# Altium schematic sheet Digital IO LS.SchDoc
size 297 x 209 mm; CompanyName: Sainsbury Wellcome Centre; Organization: FabLab; Address1: Sainsbury Wellcome Centre; Address2: 25 Howland Street; Address3: London; Address4: W1T 4JG; DocumentNumber: 9; SheetNumber: 9; SheetTotal: 12; swcgroup: FabLab; Org: Sainsbury Wellcome Centre; Add1: 25 Howland Street; Add2: London; Add3: W1T 4JG; WebAddress: www.sainsburywellcome.org; SheetSize: A4; SheetName: Level Shifter
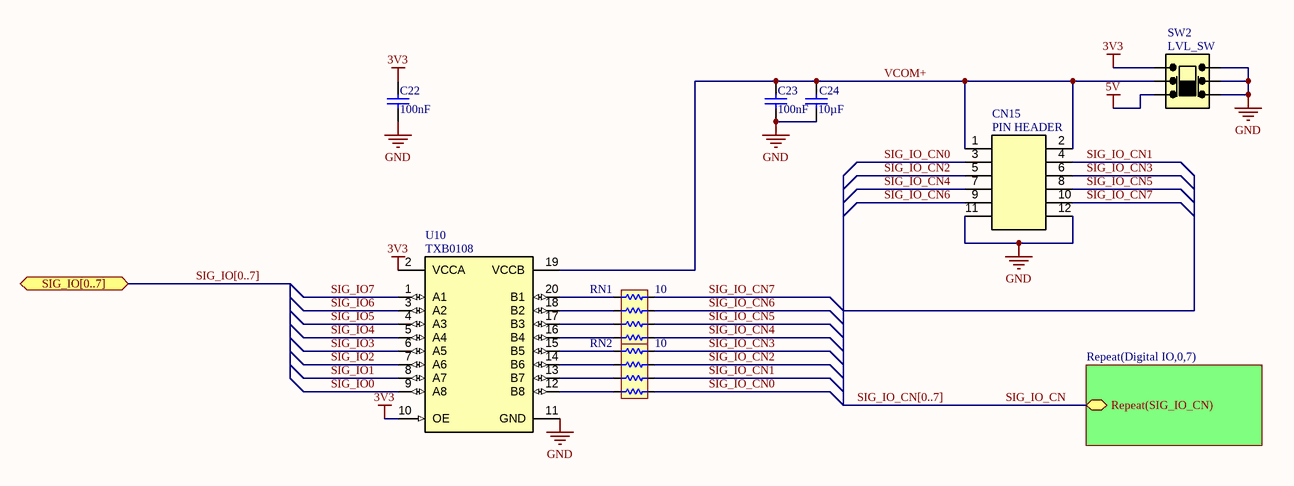
[diagram p0: Digital IO LS.SchDoc]

## Parts
C22  value 100nF  [CAP_CHIP_0603]  (hidden comment: C0603-100nF-50V)
C23  value 100nF  [CAP_CHIP_0603]  (hidden comment: C0603-100nF-50V)
C24  value 10µF  [CAP_CHIP_0603]  (hidden comment: C0603-10uF-35V)
CN15  PIN HEADER  [PIN_2.54_2X6P]
RN1  value 10  [RES_ARRAY_0603]  (hidden comment: RN0603-10R)
RN2  value 10  [RES_ARRAY_0603]  (hidden comment: RN0603-10R)
SW2  LVL_SW  [SW_SLIDE_OS202013MT8]
U10  TXB0108  [TSSOP20_6.5X4.4_0.65E]

## Sub-sheets
Repeat(Digital IO,0,7) = Digital IO Connector.SchDoc: Repeat(SIG_IO_CN) (bidir)

## Ports
SIG_IO[0..7] (bidir)

## Nets
3V3: C22.2 SW2.3(NOA) U10.2(VCCA) U10.10(OE)
5V: SW2.1(NCA)
GND: C22.1 C23.1 C24.1 CN15.11 CN15.12 SW2.4(NCB) SW2.5(COMB) SW2.6(NOB) U10.11(GND)
SIG_IO0: U10.9(A8)
SIG_IO1: U10.8(A7)
SIG_IO2: U10.7(A6)
SIG_IO3: U10.6(A5)
SIG_IO4: U10.5(A4)
SIG_IO5: U10.4(A3)
SIG_IO6: U10.3(A2)
SIG_IO7: U10.1(A1)
SIG_IO_CN: sheet Repeat(Digital IO,0,7)/Repeat(SIG_IO_CN)
SIG_IO_CN0: CN15.3 RN2.5
SIG_IO_CN1: CN15.4 RN2.6
SIG_IO_CN2: CN15.5 RN2.7
SIG_IO_CN3: CN15.6 RN2.8
SIG_IO_CN4: CN15.7 RN1.5
SIG_IO_CN5: CN15.8 RN1.6
SIG_IO_CN6: CN15.9 RN1.7
SIG_IO_CN7: CN15.10 RN1.8
VCOM+: C23.2 C24.2 CN15.1 CN15.2 SW2.2(COMA) U10.19(VCCB)
NetRN1_1: RN1.1 U10.20(B1)
NetRN1_2: RN1.2 U10.18(B2)
NetRN1_3: RN1.3 U10.17(B3)
NetRN1_4: RN1.4 U10.16(B4)
NetRN2_1: RN2.1 U10.15(B5)
NetRN2_2: RN2.2 U10.14(B6)
NetRN2_3: RN2.3 U10.13(B7)
NetRN2_4: RN2.4 U10.12(B8)

## Buses and harness runs
bus SIG_IO[0..7] = port SIG_IO[0..7]
bus SIG_IO_CN[0..7]

## Notes on the sheet
- FILE
- VARIANT
- DATE
- REVISION
- SHEET
- /
- PROJECT
- SIZE

## Library data of the parts
C22 C23 = CMP-611-0027-24: 0603 Multilayer Ceramic Capacitors MLCC; PartNumber: CC0603KRX7R9BB104; Tolerance: 10%; Pick&PlaceFootprint: C0603; Dielectric: X7R; Voltage Rating: 50V; Capacitor Type: Ceramic; RoHS: Yes; Mount: SMD; LCSC Part N.: C14663; Case/Package: 0603
C24 = CMP-611-0048-3: Ceramic Capacitor, Multilayer, Ceramic, 35V, 20% +Tol, 20% -Tol, X5R, 15% TC, 10uF, Surface Mount, 0603; PartNumber: GRM188R6YA106MA73D; Pick&PlaceFootprint: C0603; Dielectric: X5R; Capacitor Type: Ceramic; Mount: SMD; LCSC Part N.: C194427; RoHS: Yes; Tolerance: 20%; Voltage Rating: 35V; Case/Package: 0603
CN15 = CMP-380-0033-5: Straight Policy 2.5mm 6mm -40℃~+105℃ 3mm 2.54mm Double Row Black Brass 2.54mm Plugin,P=2.54mm Pin Headers; PartNumber: PZ254V-12-12P; Gender: Male; Number of Positions: 6; Number of Contacts: 12; Mount: Through Hole; Number of Rows: 2; Orientation: Straight; LCSC Part N.: C492423; Pitch: 2.54mm
RN1 RN2 = CMP-633-0183-1: Array/Network Resistor, Jumper, Metal Glaze/thick Film, 10ohm, 50V, 5% +/-Tol, -200,200ppm/Cel, Surface Mount, 1206; PartNumber: 4D03WGJ0100T5E; Element Power Dissipation: 62.5mW; Number of Resistors: 4; Pick&PlaceFootprint: R0603x4; LCSC Part N.: C11993; Voltage Rating: 50V; Power Rating: 62.5mW; Tolerance: 5%; Case/Package: 0612; Mount: SMD; RoHS: Yes
SW2 = CMP-B00-0028-1: Switch Slide ON ON DPDT Top Slide 0.3A 30VDC 10000Cycles PC Pins Thru-Hole Bulk; PartNumber: OS202013MT8QN1; Switch Travel: 3.2mm; Switch Function: On-On; Voltage Rating (DC): 30V; Throw Configuration: DPDT; Orientation: Straight; LCSC Part N.: C2799227
U10 = CMP-950-0024-1: 8-Bit Bidirectional Voltage-Level Shifter with Auto Direction Sensing and +/-15-kV ESD Protect 20-TSSOP -40 to 85; PartNumber: TXB0108PWR; Data Rate: 100Mbps; Output Type: 3-STATE; Number of Channels: 8; Min Supply Voltage: 1.2V; Max Supply Voltage: 5.5V; Propagation Delay: 4ns; Channel Type: Bidirectional; LCSC Part N.: C53406